# Altium project AddOnCard.PrjPCB
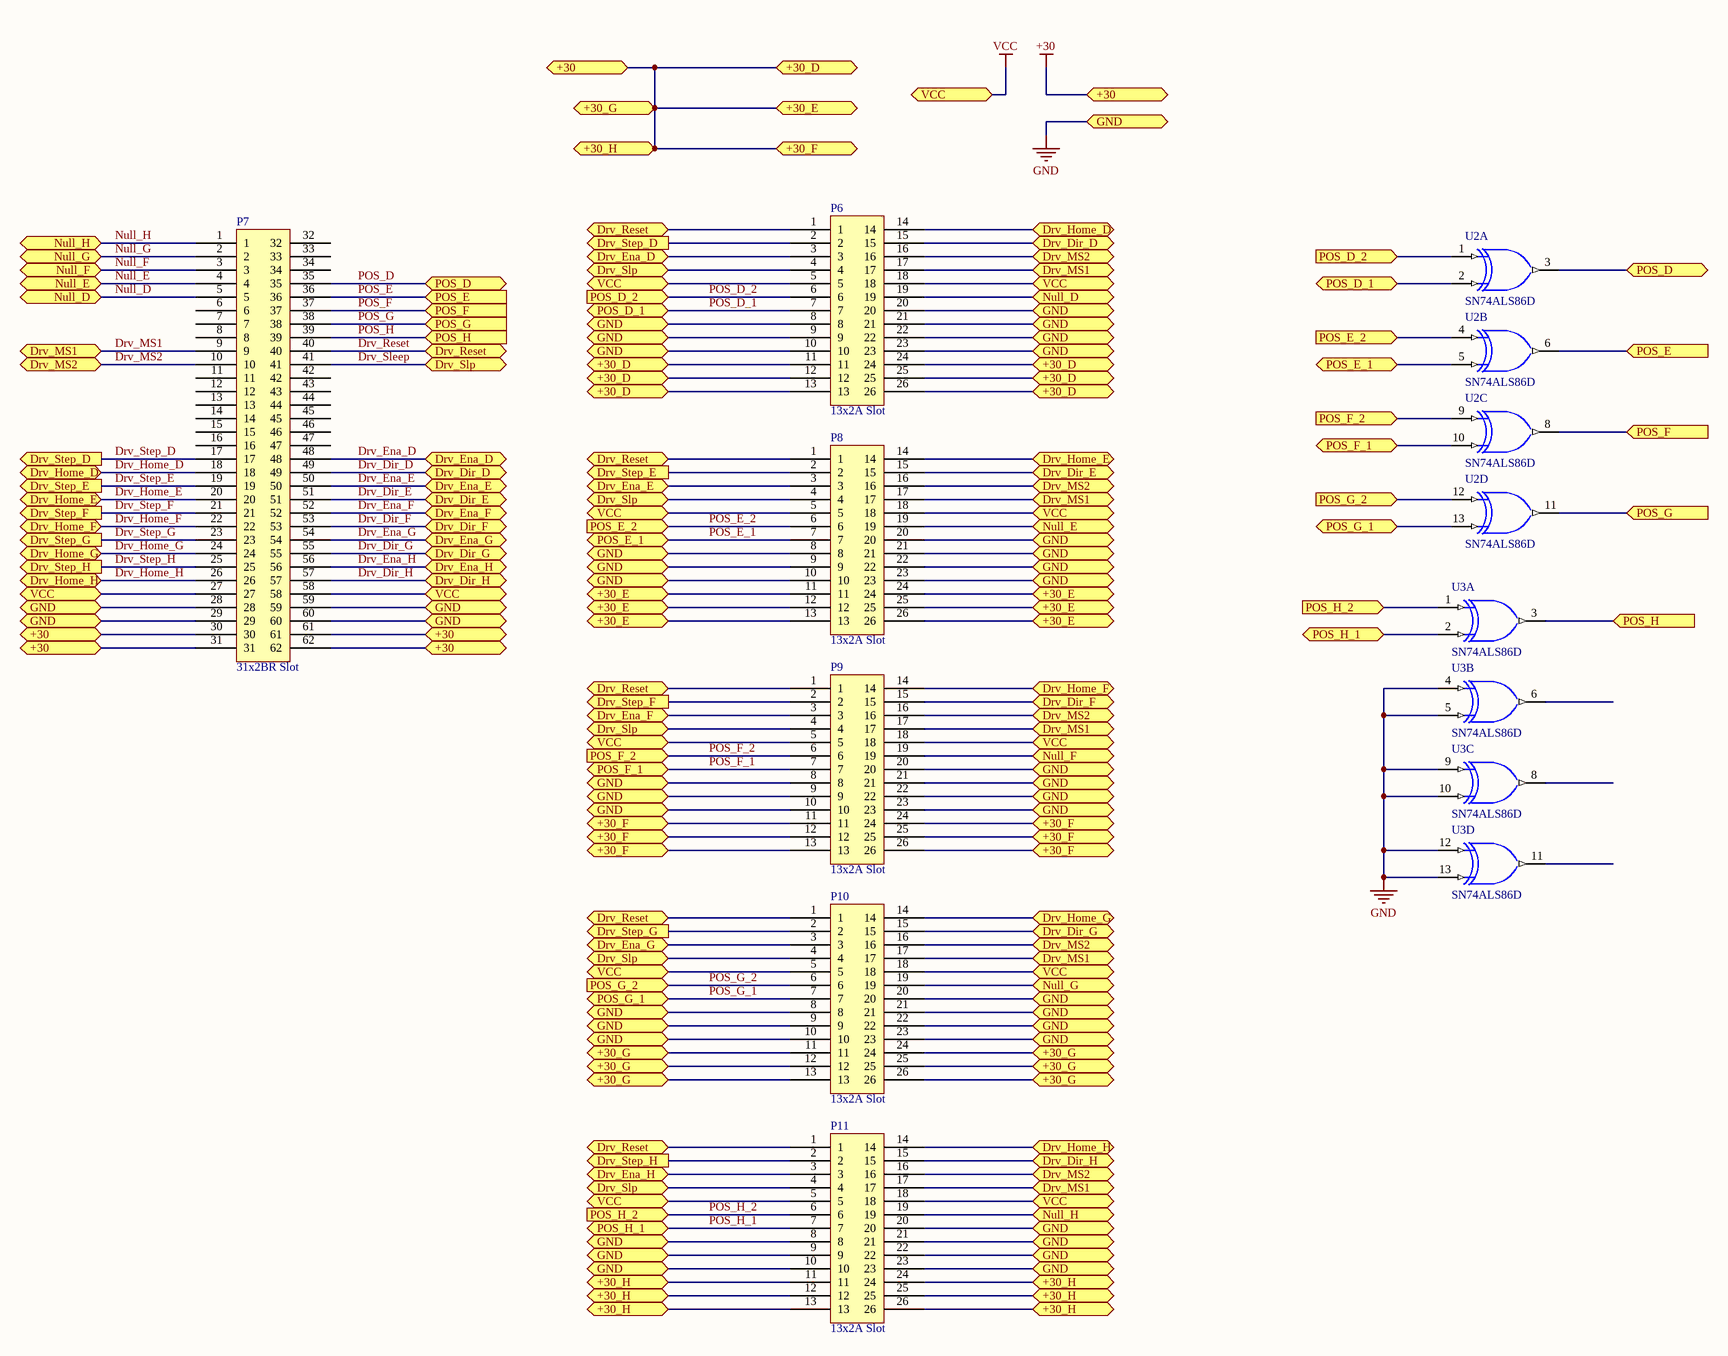
[diagram p0: AddOnCard.SchDoc]
1 sheet, 8 parts. Net scope: flat (ports and power ports of the same name join across sheets).
Board file: AddOnCard.PcbDoc

## Sheet AddOnCard.SchDoc
size A2

### Parts
P6  13x2A Slot  [SL-26A]
P7  31x2BR Slot  [SL-62BR]
P8  13x2A Slot  [SL-26A]
P9  13x2A Slot  [SL-26A]
P10  13x2A Slot  [SL-26A]
P11  13x2A Slot  [SL-26A]
U2  SN74ALS86D  [D014_N]  (parts A,B,C,D of 4)
U3  SN74ALS86D  [D014_N]  (parts A,B,C,D of 4)

### Ports
+30, +30_D, +30_E, +30_F, +30_G, +30_H, Drv_Dir_D, Drv_Dir_E, Drv_Dir_F, Drv_Dir_G, Drv_Dir_H, Drv_Ena_D, Drv_Ena_E, Drv_Ena_F, Drv_Ena_G, Drv_Ena_H, Drv_Home_D, Drv_Home_E, Drv_Home_F, Drv_Home_G, Drv_Home_H, Drv_MS1, Drv_MS2, Drv_Reset, Drv_Slp, Drv_Step_D (out), Drv_Step_E (out), Drv_Step_F (out), Drv_Step_G (out), Drv_Step_H (out), GND, Null_D, Null_E, Null_F, Null_G, Null_H, POS_D, POS_D_1, POS_D_2 (in), POS_E (in), POS_E_1, POS_E_2 (in), POS_F (in), POS_F_1, POS_F_2 (in), POS_G (in), POS_G_1, POS_G_2 (in), POS_H (in), POS_H_1, POS_H_2 (in), VCC

### Nets
+30: P6.11 P6.12 P6.13 P6.24 P6.25 P6.26 P7.30 P7.31 P7.61 P7.62 P8.11 P8.12 P8.13 P8.24 P8.25 P8.26 P9.11 P9.12 P9.13 P9.24 P9.25 P9.26 P10.11 P10.12 P10.13 P10.24 P10.25 P10.26 P11.11 P11.12 P11.13 P11.24 P11.25 P11.26 ; port +30_F, port +30_E, port +30, port +30_H, port +30_G, port +30_D
GND: P6.8 P6.9 P6.10 P6.20 P6.21 P6.22 P6.23 P7.28 P7.29 P7.59 P7.60 P8.8 P8.9 P8.10 P8.20 P8.21 P8.22 P8.23 P9.8 P9.9 P9.10 P9.20 P9.21 P9.22 P9.23 P10.8 P10.9 P10.10 P10.20 P10.21 P10.22 P10.23 P11.8 P11.9 P11.10 P11.20 P11.21 P11.22 P11.23 U2.7(GND) U3.4(A) U3.5(B) U3.7(GND) U3.9(A) U3.10(B) U3.12(A) U3.13(B) ; port GND
VCC: P6.5 P6.18 P7.27 P7.58 P8.5 P8.18 P9.5 P9.18 P10.5 P10.18 P11.5 P11.18 U2.14(VCC) U3.14(VCC) ; port VCC
Drv_Dir_D: P6.15 P7.49 ; port Drv_Dir_D
Drv_Dir_E: P7.51 P8.15 ; port Drv_Dir_E
Drv_Dir_F: P7.53 P9.15 ; port Drv_Dir_F
Drv_Dir_G: P7.55 P10.15 ; port Drv_Dir_G
Drv_Dir_H: P7.57 P11.15 ; port Drv_Dir_H
Drv_Ena_D: P6.3 P7.48 ; port Drv_Ena_D
Drv_Ena_E: P7.50 P8.3 ; port Drv_Ena_E
Drv_Ena_F: P7.52 P9.3 ; port Drv_Ena_F
Drv_Ena_G: P7.54 P10.3 ; port Drv_Ena_G
Drv_Ena_H: P7.56 P11.3 ; port Drv_Ena_H
Drv_Home_D: P6.14 P7.18 ; port Drv_Home_D
Drv_Home_E: P7.20 P8.14 ; port Drv_Home_E
Drv_Home_F: P7.22 P9.14 ; port Drv_Home_F
Drv_Home_G: P7.24 P10.14 ; port Drv_Home_G
Drv_Home_H: P7.26 P11.14 ; port Drv_Home_H
Drv_MS1: P6.17 P7.9 P8.17 P9.17 P10.17 P11.17 ; port Drv_MS1
Drv_MS2: P6.16 P7.10 P8.16 P9.16 P10.16 P11.16 ; port Drv_MS2
Drv_Reset: P6.1 P7.40 P8.1 P9.1 P10.1 P11.1 ; port Drv_Reset
Drv_Sleep: P6.4 P7.41 P8.4 P9.4 P10.4 P11.4 ; port Drv_Slp
Drv_Step_D: P6.2 P7.17 ; port Drv_Step_D
Drv_Step_E: P7.19 P8.2 ; port Drv_Step_E
Drv_Step_F: P7.21 P9.2 ; port Drv_Step_F
Drv_Step_G: P7.23 P10.2 ; port Drv_Step_G
Drv_Step_H: P7.25 P11.2 ; port Drv_Step_H
Null_D: P6.19 P7.5 ; port Null_D
Null_E: P7.4 P8.19 ; port Null_E
Null_F: P7.3 P9.19 ; port Null_F
Null_G: P7.2 P10.19 ; port Null_G
Null_H: P7.1 P11.19 ; port Null_H
POS_D: P7.35 U2.3(Y) ; port POS_D
POS_D_1: P6.7 U2.2(B) ; port POS_D_1
POS_D_2: P6.6 U2.1(A) ; port POS_D_2
POS_E: P7.36 U2.6(Y) ; port POS_E
POS_E_1: P8.7 U2.5(B) ; port POS_E_1
POS_E_2: P8.6 U2.4(A) ; port POS_E_2
POS_F: P7.37 U2.8(Y) ; port POS_F
POS_F_1: P9.7 U2.10(B) ; port POS_F_1
POS_F_2: P9.6 U2.9(A) ; port POS_F_2
POS_G: P7.38 U2.11(Y) ; port POS_G
POS_G_1: P10.7 U2.13(B) ; port POS_G_1
POS_G_2: P10.6 U2.12(A) ; port POS_G_2
POS_H: P7.39 U3.3(Y) ; port POS_H
POS_H_1: P11.7 U3.2(B) ; port POS_H_1
POS_H_2: P11.6 U3.1(A) ; port POS_H_2

Not connected (* = marked no-connect by the designer): P7 6 7 8 11 12 13 14 15 16 32 33 34 42 43 44 45 46 47; U3 6(Y) 8(Y) 11(Y)

### Library data of the parts
P7 = 31x2BR Slot: 31x2 Slot
U2 U3 = SN74ALS86D: Quadruple 2-Input Exclusive-OR Gate; Published: 8-Jun-2000; LatestRevisionDate: 13-Apr-2006; LatestRevisionNote: IPC-7351 Footprint Added.; DatasheetVersion: Dec-1994; PackageVersion: Jan-1998; PackageReference: D014; Publisher: Altium Limited; PackageDescription: 14-Pin Small Outline Integrated Circuit 1.27 mm Pitch; Code_IPC: SOIC127P600-14; ComponentLink1Description: Manufacturer Link; ComponentLink1URL: http://www.ti.com/; ComponentLink2Description: Datasheet; ComponentLink2URL: http://www-s.ti.com/sc/ds/sn54als86.pdf; ComponentLink3Description: Packaging Specification; ComponentLink3URL: http://focus.ti.com/lit/ml/mpds177/mpds177.pdf